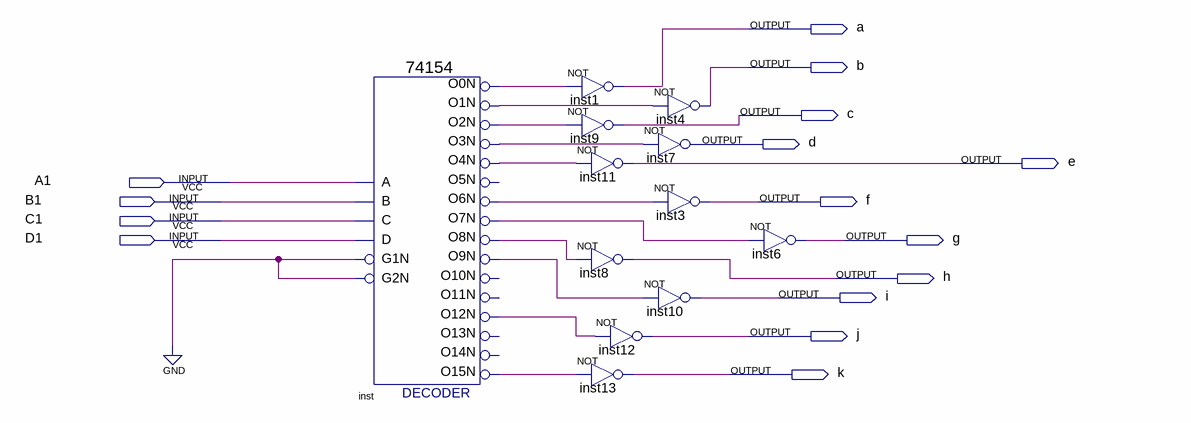
[diagram p0: schematic sheet]
// Quartus schematic lab9.bdf as structural Verilog: 12 symbols, 15 pins
module lab9 (
  input  A1,
  input  B1,
  input  C1,
  input  D1,
  output a,
  output b,
  output c,
  output d,
  output e,
  output f,
  output g,
  output h,
  output i,
  output j,
  output k
);

  wire inst_o0n, inst_o1n, inst_o2n, inst_o3n, inst_o4n, inst_o6n, inst_o7n, inst_o8n, inst_o9n, inst_o12n,
       inst_o15n;

  \74154  inst (
    .C(C1), .D(D1), .B(B1), .A(A1), .G1N(1'b0), .G2N(1'b0), .O0N(inst_o0n), .O12N(inst_o12n),
    .O15N(inst_o15n), .O1N(inst_o1n), .O4N(inst_o4n), .O3N(inst_o3n), .O2N(inst_o2n), .O7N(inst_o7n),
    .O6N(inst_o6n), .O9N(inst_o9n), .O8N(inst_o8n));  // open: O10N, O11N, O13N, O14N, O5N
  not inst1 (a, inst_o0n);
  not inst9 (c, inst_o2n);
  not inst11 (e, inst_o4n);
  not inst8 (h, inst_o8n);
  not inst12 (j, inst_o12n);
  not inst13 (k, inst_o15n);
  not inst4 (b, inst_o1n);
  not inst7 (d, inst_o3n);
  not inst3 (f, inst_o6n);
  not inst10 (i, inst_o9n);
  not inst6 (g, inst_o7n);
endmodule
